# Altium schematic sheet 1_P1.schdoc
size 309 x 223 mm; Symbol: Sheet-Symbol_A4; Device: Sheet-Symbol_A4; @Page Name: P1; @Create Date: 2022-12-16; @Page Count: 1; @Page No: 1; @Project Name: smartcar2023; @Schematic Name: Schematic1; @Update Date: 2023-01-03; Company: 嘉立创EDA; Page Size: A4; Version: V1.0
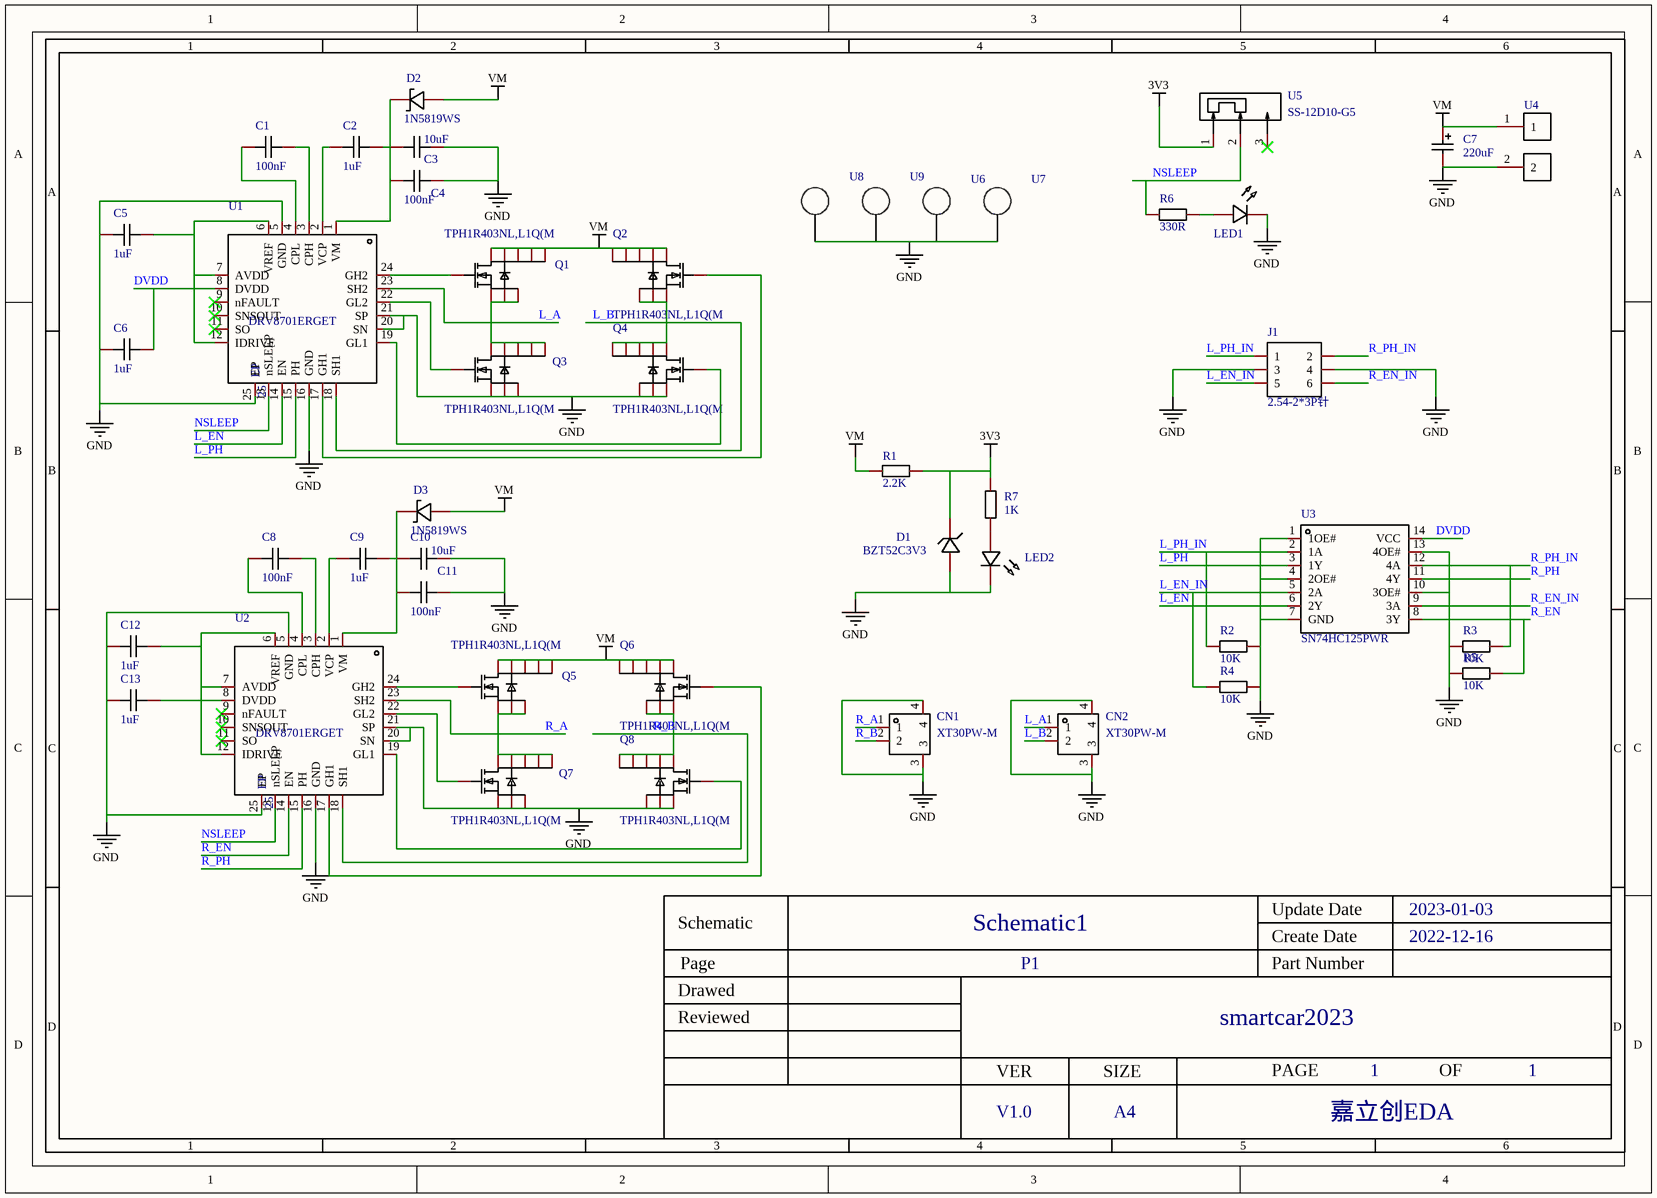
[diagram p0: 1_P1.schdoc]

## Parts
C1  100nF  [C0603]
C2  1uF  [C0603]
C3  10uF  [C0603]
C4  100nF  [C0603]
C5  1uF  [C0603]
C6  1uF  [C0603]
C7  220uF  [CAP-SMD_BD6.3-L6.6-W6.6-LS7.4-FD]
C8  100nF  [C0603]
C9  1uF  [C0603]
C10  10uF  [C0603]
C11  100nF  [C0603]
C12  1uF  [C0603]
C13  1uF  [C0603]
CN1  XT30PW-M  [CONN-TH_XT30PW-M]
CN2  XT30PW-M  [CONN-TH_XT30PW-M]
D1  BZT52C3V3  [SOD-123_L2.7-W1.6-LS3.7-RD-1]
D2  1N5819WS  [SOD-323_L1.8-W1.3-LS2.5-RD]
D3  1N5819WS  [SOD-323_L1.8-W1.3-LS2.5-RD]
J1  2.54-2*3P针  [HDR-TH_6P-P2.54-V-M-R2-C3-S2.54-1]
LED1  LED_0603-R  [LED_0603]  (value not drawn)
LED2  LED_0603-R  [LED_0603]  (value not drawn)
Q1  TPH1R403NL,L1Q(M  [DSOP-8_L5.0-W5.0-P1.27-LS6.0-BL-EP]
Q2  TPH1R403NL,L1Q(M  [DSOP-8_L5.0-W5.0-P1.27-LS6.0-BL-EP]
Q3  TPH1R403NL,L1Q(M  [DSOP-8_L5.0-W5.0-P1.27-LS6.0-BL-EP]
Q4  TPH1R403NL,L1Q(M  [DSOP-8_L5.0-W5.0-P1.27-LS6.0-BL-EP]
Q5  TPH1R403NL,L1Q(M  [DSOP-8_L5.0-W5.0-P1.27-LS6.0-BL-EP]
Q6  TPH1R403NL,L1Q(M  [DSOP-8_L5.0-W5.0-P1.27-LS6.0-BL-EP]
Q7  TPH1R403NL,L1Q(M  [DSOP-8_L5.0-W5.0-P1.27-LS6.0-BL-EP]
Q8  TPH1R403NL,L1Q(M  [DSOP-8_L5.0-W5.0-P1.27-LS6.0-BL-EP]
R1  2.2K  [R0603]
R2  10K  [R0603]
R3  10K  [R0603]
R4  10K  [R0603]
R5  10K  [R0603]
R6  330R  [R0603]
R7  1K  [R0603]
U1  NAME: EP  NUMBER: 25  [VQFN-24_L4.0-W4.0-P0.50-LS4.0-BL-EP]  (hidden comment: DRV8701ERGET)
U2  NAME: EP  NUMBER: 25  [VQFN-24_L4.0-W4.0-P0.50-LS4.0-BL-EP]  (hidden comment: DRV8701ERGET)
U3  SN74HC125PWR  [TSSOP-14_L5.0-W4.4-P0.65-LS6.5-BL]
U4  电源线焊盘  [电源线焊盘]  (value not drawn)
U5  SS-12D10-G5  [SW-TH_SS-12D10-G050]
U6  M3-MountSlot  [M3-MountSlot]  (value not drawn)
U7  M3-MountSlot  [M3-MountSlot]  (value not drawn)
U8  M3-MountSlot  [M3-MountSlot]  (value not drawn)
U9  M3-MountSlot  [M3-MountSlot]  (value not drawn)

## Nets
3V3: D1.1 R1.1 R7.2 U5.1
GND: C3.2 C4.2 C5.1 C6.1 C7.2 C10.2 C11.2 C12.1 C13.1 CN1.3 CN1.4 CN2.3 CN2.4 D1.2 J1.3 J1.4 LED1.1(C) LED2.1(C) Q3.1(S) Q3.2(S) Q3.3(S) Q4.1(S) Q4.2(S) Q4.3(S) Q7.1(S) Q7.2(S) Q7.3(S) Q8.1(S) Q8.2(S) Q8.3(S) R2.1 R3.2 R4.1 R5.2 U1.5(GND) U1.16(GND) U1.20(SN) U1.21(SP) U1.25(EP) U2.5(GND) U2.16(GND) U2.20(SN) U2.21(SP) U2.25(EP) U3.1(1OE#) U3.4(2OE#) U3.7(GND) U3.10(3OE#) U3.13(4OE#) U4.2 U6.1 U7.1 U8.1 U9.1
VM: C7.1 D2.2(A) D3.2(A) Q1.5(D) Q1.6(D) Q1.7(D) Q1.8(D) Q1.9(D) Q2.5(D) Q2.6(D) Q2.7(D) Q2.8(D) Q2.9(D) Q5.5(D) Q5.6(D) Q5.7(D) Q5.8(D) Q5.9(D) Q6.5(D) Q6.6(D) Q6.7(D) Q6.8(D) Q6.9(D) R1.2 U4.1
DVDD: C6.2 U1.8(DVDD) U3.14(VCC)
L_A: CN2.1 Q1.1(S) Q1.2(S) Q1.3(S) Q3.5(D) Q3.6(D) Q3.7(D) Q3.8(D) Q3.9(D) U1.23(SH2)
L_B: CN2.2 Q2.1(S) Q2.2(S) Q2.3(S) Q4.5(D) Q4.6(D) Q4.7(D) Q4.8(D) Q4.9(D) U1.18(SH1)
L_EN: U1.14(EN) U3.6(2Y)
L_EN_IN: J1.5 R4.2 U3.5(2A)
L_PH: U1.15(PH) U3.3(1Y)
L_PH_IN: J1.1 R2.2 U3.2(1A)
NSLEEP: R6.1 U1.13(nSLEEP) U2.13(nSLEEP) U5.2
R_A: CN1.1 Q5.1(S) Q5.2(S) Q5.3(S) Q7.5(D) Q7.6(D) Q7.7(D) Q7.8(D) Q7.9(D) U2.23(SH2)
R_B: CN1.2 Q6.1(S) Q6.2(S) Q6.3(S) Q8.5(D) Q8.6(D) Q8.7(D) Q8.8(D) Q8.9(D) U2.18(SH1)
R_EN: R5.1 U2.14(EN) U3.8(3Y)
R_EN_IN: J1.6 U3.9(3A)
R_PH: U2.15(PH) U3.11(4Y)
R_PH_IN: J1.2 R3.1 U3.12(4A)
NetC1_1: C1.1 U1.4(CPL)
NetC1_2: C1.2 U1.3(CPH)
NetC2_1: C2.1 U1.2(VCP)
NetC2_2: C2.2 C3.1 C4.1 D2.1(C) U1.1(VM)
NetC5_2: C5.2 U1.6(VREF) U1.7(AVDD) U1.12(IDRIVE)
NetC8_1: C8.1 U2.4(CPL)
NetC8_2: C8.2 U2.3(CPH)
NetC9_1: C9.1 U2.2(VCP)
NetC9_2: C9.2 C10.1 C11.1 D3.1(C) U2.1(VM)
NetC12_2: C12.2 U2.6(VREF) U2.7(AVDD) U2.12(IDRIVE)
NetC13_2: C13.2 U2.8(DVDD)
NetLED1_2: LED1.2(A) R6.2
NetLED2_2: LED2.2(A) R7.1
NetQ1_4: Q1.4(G) U1.24(GH2)
NetQ2_4: Q2.4(G) U1.17(GH1)
NetQ3_4: Q3.4(G) U1.22(GL2)
NetQ4_4: Q4.4(G) U1.19(GL1)
NetQ5_4: Q5.4(G) U2.24(GH2)
NetQ6_4: Q6.4(G) U2.17(GH1)
NetQ7_4: Q7.4(G) U2.22(GL2)
NetQ8_4: Q8.4(G) U2.19(GL1)

Not connected (* = marked no-connect by the designer): U1 9(nFAULT)* 10(SNSOUT)* 11(SO)*; U2 9(nFAULT)* 10(SNSOUT)* 11(SO)*; U5 3*

## Notes on the sheet
- 1
- 2
- 3
- 4
- 5
- 6
- A
- B
- C
- Schematic
- Schematic1
- Create Date
- Update Date
- 2022-12-16
- 2023-01-03
- Reviewed
- Drawed
- Page
- P1
- Part Number
- smartcar2023
- D
- VER
- SIZE
- PAGE
- OF
- V1.0
- A4
- 嘉立创EDA

## Library data of the parts
C1-C6 C8-C13 = CAP_0603: Symbol: CapAcitance; Convert to PCB: yes; Device: CAP_0603; Add into BOM: yes; Supplier Footprint: 0603
  C1 C4 C8 C11: Name: 100nF; Value: 100nF
  C2 C5 C6 C9 C12 C13: Name: 1uF; Value: 1uF
  C3 C10: Name: 10uF; Value: 10uF
C7 = RVT1E221M0607: 容值:220uF;精度:±20%;额定电压:25V;电容体直径:6.3mm;电容体长度:7.7mm;纹波电流:150mA@120Hz;等效串联电阻:-;工作寿命:-;工作温度:-40℃~+105℃;; Manufacturer: ROQANG(容强); Symbol: RVT1E221M0607_C2918361; Add into BOM: yes; Tolerance: ±20%; Rated Voltage: 25V; φD: 6.3mm; L: 7.7mm; Name: 220uF; Device: RVT1E221M0607; LCSC Part Name: 220uF ±20% 25V; Supplier Part: C2918361; Manufacturer Part: RVT1E221M0607; Supplier Footprint: SMD,D6.3xL7.7mm; JLCPCB Part Class: Extended Part; Datasheet: https://atta.szlcsc.com/upload/public/pdf/source/20211118/497C0614266278696CA52BDF245B991F.pdf; Supplier: LCSC; Convert to PCB: yes; Value: 220uF; Ripple Current: 150mA@120Hz; Equivalent Series Resistance(ESR): -; Lifetime @ Temp: -; Operating Temperature: -40℃~+105℃
CN1 CN2 = XT30PW-M: Socket,DCsupply,XT30,male,PIN:2; Manufacturer: AMASS(艾迈斯); Add into BOM: yes; Name: XT30PW-M; Symbol: XT30PW-M; Device: XT30PW-M; LCSC Part Name: XT30PW-M公头; Supplier Part: C431092; Manufacturer Part: XT30PW-M; Supplier Footprint: -; JLCPCB Part Class: Extended Part; Datasheet: https://atta.szlcsc.com/upload/public/pdf/source/20220222/6A9F22F7850E25B33E1BE430ADF8560B.pdf; Supplier: LCSC; Convert to PCB: yes
D1 = BZT52C3V3: 二极管配置:-;稳压值(标称值):3.3V;稳压值(范围):3.3V~3.5V;功率:500mW;反向电流(Ir):5uA@1V;阻抗(Zzt):95Ω;; Manufacturer: YONGYUTAI(永裕泰); Symbol: BZT52C3V3_C2891770; Add into BOM: yes; Zener Voltage (Nom): 3.3V; Power Dissipation: 500mW; Reverse Leakage Current (Ir): 5uA@1V; Zener Impedance (Zzt): 95Ω; Name: BZT52C3V3; Device: BZT52C3V3; LCSC Part Name: 3.3V 500mW; Supplier Part: C2891770; Manufacturer Part: BZT52C3V3; Supplier Footprint: SOD-123; JLCPCB Part Class: Extended Part; Datasheet: https://atta.szlcsc.com/upload/public/pdf/source/20210901/8FC2376A01E96D0346FF8B134DC7A446.pdf; Supplier: LCSC; Convert to PCB: yes; Diode Configuration: -; Zener Voltage (Range): 3.3V~3.5V
D2 D3 = 1N5819WS_C191023: 直流反向耐压(Vr):40V;平均整流电流(Io):1A;正向压降(Vf):600mV@1A;; Manufacturer: Hottech(合科泰); Add into BOM: yes; Reverse Voltage (Vr): 40V; Average Rectified Current (Io): 1A; Name: 1N5819WS; Symbol: 1N5819WS; Device: 1N5819WS_C191023; LCSC Part Name: 40V 1A 600mV@1A; Supplier Part: C191023; Manufacturer Part: 1N5819WS; Supplier Footprint: SOD-323; JLCPCB Part Class: Basic Part; Datasheet: https://atta.szlcsc.com/upload/public/pdf/source/20220428/3CB86FD8D28D653594B4E35F9D5AEFD9.pdf; Supplier: LCSC; Convert to PCB: yes; Forward Voltage (Vf@If): 600mV@1A
J1 = 2.54-2*3P针: 间距:2.54mm;总PIN位数:6;排数:2;插针结构:-;行距:-;安装类型:直插;圆针/方针:-;额定电流:-;额定电压:-;配合针长度:-;塑高:-;触头材质:-;触头镀层:-;颜色:黑色;; Manufacturer: BOOMELE(博穆精密); Symbol: Header-Male-2.54_2x3; Add into BOM: yes; Pitch: 2.54mm; Name: 2.54-2*3P针; Device: 2.54-2*3P针; LCSC Part Name: 2.54mm 直插; Supplier Part: C65114; Manufacturer Part: 2.54-2*3P针; Supplier Footprint: 直插,P=2.54mm; JLCPCB Part Class: Extended Part; Datasheet: https://atta.szlcsc.comnull; Supplier: LCSC; Convert to PCB: yes; Number of Pins: 6; Number of Rows: 2; Pin Structure: -; Row Spacing: -; Mounting Type: 直插; Circluar Pins/Square Pins: -; Current Rating (Max): -; Voltage Rating (Max): -; Length of Mating Pin: -; Insulation Height: -; Contact Material: -; Contact Plating: -; Color: 黑色
LED1 LED2 = LED_0603-R: Symbol: LED_R; Convert to PCB: yes; Device: LED_0603-R; Add into BOM: yes; Supplier Footprint: 0603
Q1-Q8 = TPH1R403NL,L1Q(M: Manufacturer: TOSHIBA(东芝); Add into BOM: yes; Name: TPH1R403NL,L1Q(M; Symbol: TPH1R403NL,L1Q(M; Device: TPH1R403NL,L1Q(M; LCSC Part Name: TPH1R403NL,L1Q(M; Supplier Part: C2940403; Manufacturer Part: TPH1R403NL,L1Q(M; Supplier Footprint: SOP-8; Datasheet: https://atta.szlcsc.com/upload/public/pdf/source/20220830/C277A7BCA37DB7348B2C95BA2E6DA6BE.pdf; Supplier: LCSC; Convert to PCB: yes
R1-R7 = Res_0603: Symbol: 电阻; Convert to PCB: yes; Device: Res_0603; Add into BOM: yes; Supplier Footprint: 0603
  R1: Name: 2.2K; Value: 2.2K
  R2-R5: Name: 10K; Value: 10K
  R6: Name: 330R; Value: 330R
  R7: Name: 1K; Value: 1K
U1 U2 = DRV8701ERGET: DRV8701 DRV8701 H 桥栅极驱动器; Manufacturer: TI(德州仪器); Add into BOM: yes; Name: DRV8701ERGET; Symbol: DRV8701ERGET; Device: DRV8701ERGET; LCSC Part Name: DRV8701ERGET; Supplier Part: C132049; Manufacturer Part: DRV8701ERGET; Supplier Footprint: VQFN-24; JLCPCB Part Class: Extended Part; Datasheet: https://atta.szlcsc.com/upload/public/pdf/source/20170925/C132049_1506321643935990409.pdf; Supplier: LCSC; Convert to PCB: yes
U3 = SN74HC125PWR: 逻辑电路的归属系列:74HC;逻辑类型:缓冲器，非反向;元件数:4;每元件位数:1;; Manufacturer: TI(德州仪器); Add into BOM: yes; Number of Elements: 4; Number of Bits per Element: 1; Output Type: 三态; Current - Output High, Low: 7.8mA、7.8mA; Voltage - Supply: 2V ~ 6V; Name: SN74HC125PWR; Symbol: SN74HC125PWR; Device: SN74HC125PWR; LCSC Part Name: SN74HC125PWR; Supplier Part: C132994; Manufacturer Part: SN74HC125PWR; Supplier Footprint: TSSOP-14; JLCPCB Part Class: Extended Part; Datasheet: https://atta.szlcsc.com/upload/public/pdf/source/20170930/C132994_1506736365150997346.pdf; Supplier: LCSC; Convert to PCB: yes; Series: 74HC; Logic Type: 缓冲器，非反向; Input Type: -; Operating Temperature: -40℃~+85℃（TA）
U4 = 电源线焊盘: Add into BOM: yes; Symbol: 电源线焊盘; Device: 电源线焊盘; Convert to PCB: yes
U5 = SS-12D10-G5: 电路结构:单刀双掷;安装方式:直插;开关颜色:黑色;滑钮形状:矩形柱状;引脚样式:PC引脚;开关长度:12.7mm;开关宽度:6.7mm;开关高度:11.3mm;; Manufacturer: DEALON(德艺隆); Add into BOM: yes; Circuit: 单刀双掷; Actuator Color: 黑色; Actuator Style: 矩形柱状; Pin Style: PC引脚; Switch Length: 12.7mm; Switch Width: 6.7mm; Switch Height: 11.3mm; Name: SS-12D10-G5; Symbol: SS-12D10-G5; Device: SS-12D10-G5; LCSC Part Name: 插件大电流拨动开关; Supplier Part: C2998777; Manufacturer Part: SS-12D10-G5; Supplier Footprint: 插件; JLCPCB Part Class: Extended Part; Datasheet: https://atta.szlcsc.com/upload/public/pdf/source/20220428/E10CB334ACBAF32CF4AF8D87DA871CD3.pdf; Supplier: LCSC; Convert to PCB: yes; Mounting Style: 直插
U6-U9 = M3-MountSlot: Add into BOM: yes; Symbol: M3-MountSlot; Device: M3-MountSlot; Convert to PCB: yes